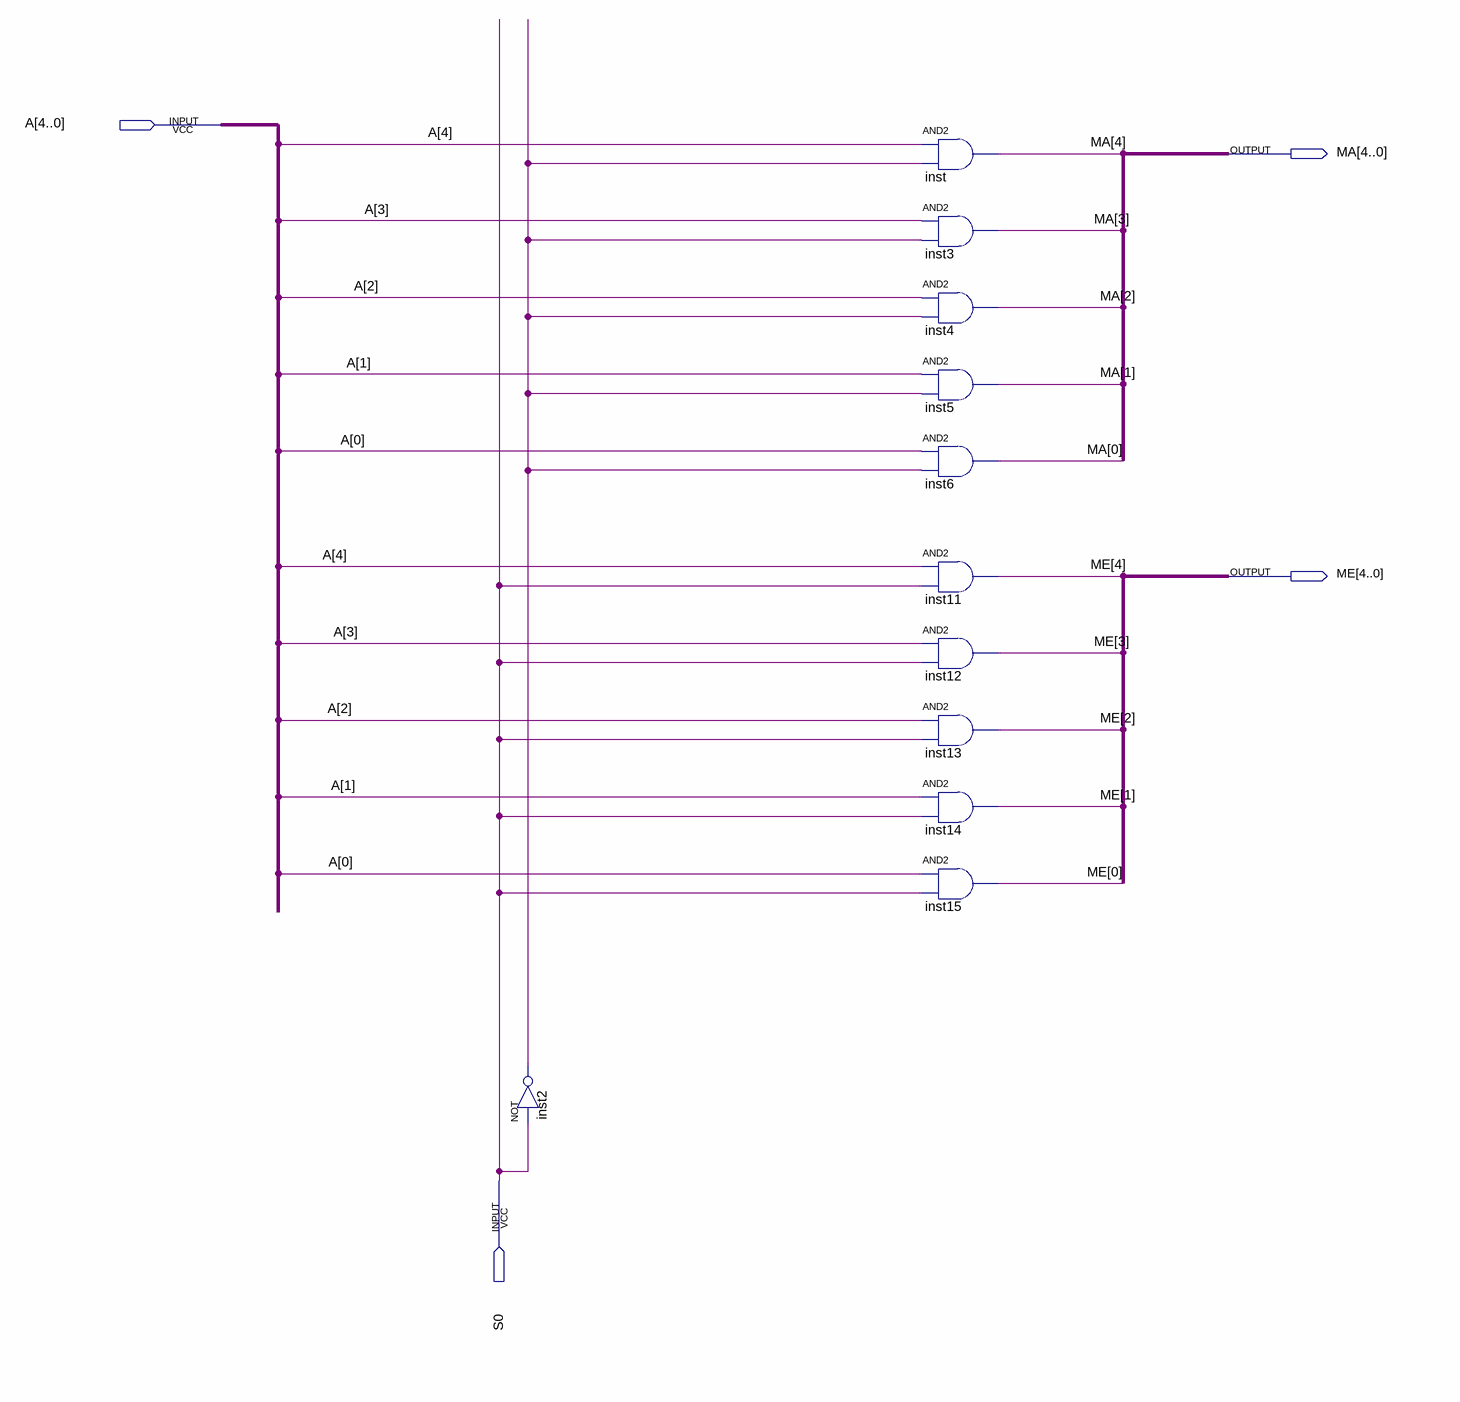
[diagram p0: schematic sheet]
// Quartus schematic demux1x2_5bits.bdf as structural Verilog: 11 symbols, 4 pins
module demux1x2_5bits (
  input  [4:0] A,
  input  S0,
  output [4:0] MA,
  output [4:0] ME
);

  wire inst2_out;

  not inst2 (inst2_out, S0);
  and inst (MA[4], A[4], inst2_out);
  and inst3 (MA[3], A[3], inst2_out);
  and inst4 (MA[2], A[2], inst2_out);
  and inst5 (MA[1], A[1], inst2_out);
  and inst6 (MA[0], A[0], inst2_out);
  and inst11 (ME[4], A[4], S0);
  and inst12 (ME[3], A[3], S0);
  and inst13 (ME[2], A[2], S0);
  and inst14 (ME[1], A[1], S0);
  and inst15 (ME[0], A[0], S0);
endmodule
